# Altium schematic sheet LCD.SchDoc
size A4
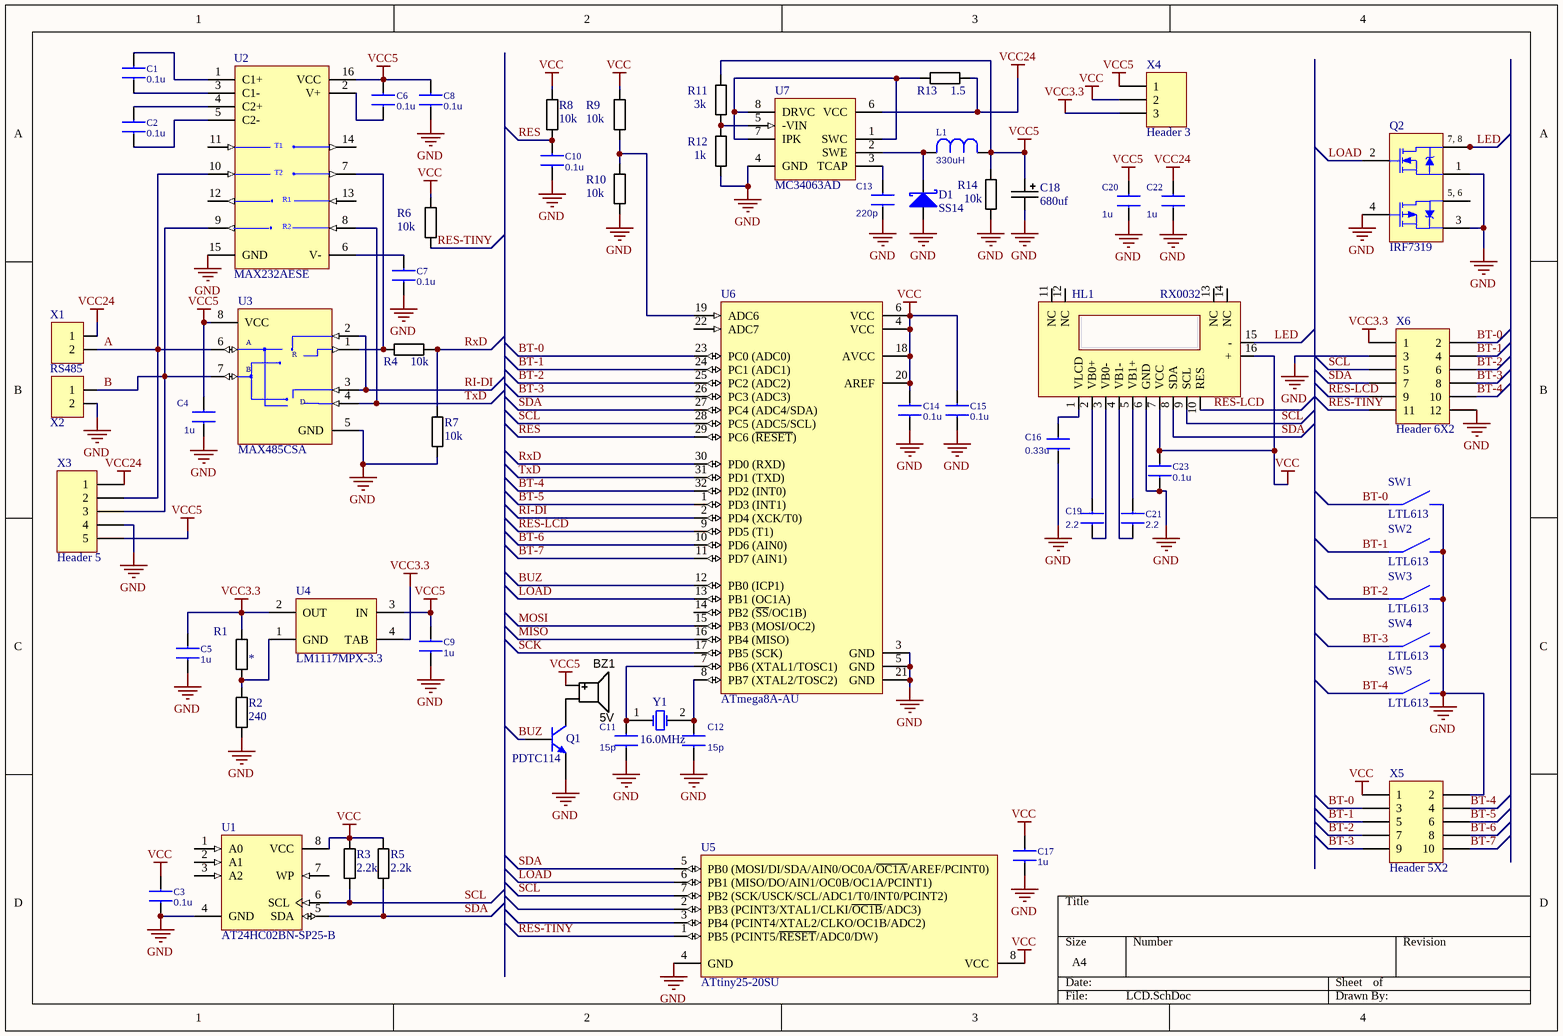
[diagram p0: LCD.SchDoc]

## Parts
BZ1  Manufacturer Part Number 1: 5V  [BUZZER_12.0X8.5MM]  (hidden comment: Alternate part: 3100-932)
C1  0.1u  [C_0805]
C2  0.1u  [C_0805]
C3  0.1u  [C_0805]
C4  1u  [C_0805]
C5  1u  [C_0805]
C6  0.1u  [C_0805]
C7  0.1u  [C_0805]
C8  0.1u  [C_0805]
C9  1u  [C_0805]
C10  0.1u  [C_0805]
C11  15p  [C_0603]
C12  15p  [C_0603]
C13  220p  [C_0805]
C14  0.1u  [C_0805]
C15  0.1u  [C_0805]
C16  0.33u  [C_0805]
C17  1u  [C_0805]
C18  value 680uf  [PCBComponent_1]  (hidden comment: Component_1)
C19  2.2  [C_1206]
C20  1u  [C_0805]
C21  2.2  [C_1206]
C22  1u  [C_0805]
C23  0.1u  [C_0805]
D1  SS14  [DO-214AC]
HL1  RX0032  [RX0032]
L1  330uH  [CDRH74]
Q1  PDTC114  [SOT-23B_N]
Q2  IRF7319  [SO-8]
R1  *  [Resistor 0805]
R2  240  [Resistor 0805]
R3  value 2.2k  [Resistor 0603]  (hidden comment: 3k)
R4  value 10k  [Resistor 0603]  (hidden comment: 3k)
R5  value 2.2k  [Resistor 0603]  (hidden comment: 3k)
R6  value 10k  [Resistor 0603]  (hidden comment: 3k)
R7  value 10k  [Resistor 0603]  (hidden comment: 3k)
R8  value 10k  [Resistor 0603]  (hidden comment: 3k)
R9  value 10k  [Resistor 0603]  (hidden comment: 3k)
R10  value 10k  [Resistor 0603]  (hidden comment: 3k)
R11  3k  [Resistor 0603]
R12  1k  [Resistor 0603]
R13  value 1.5  [Resistor 1206]  (hidden comment: 3k)
R14  value 10k  [Resistor 0603]  (hidden comment: 3k)
SW1  LTL613  [LTL613]
SW2  LTL613  [LTL613]
SW3  LTL613  [LTL613]
SW4  LTL613  [LTL613]
SW5  LTL613  [LTL613]
U1  AT24HC02BN-SP25-B  [8S1_N]
U2  MAX232AESE  [NSO16_N]
U3  MAX485CSA  [NSO8_N]
U4  LM1117MPX-3.3  [MP04A_N]
U5  ATtiny25-20SU  [8S2_N]
U6  ATmega8A-AU  [32A_N]
U7  MC34063AD  [751-02_N]
X1  DG-2P-35  [DG-2P-35]  (value not drawn)
X2  FOR: RS485  [DG-2P-35]  (hidden comment: DG-2P-35)
X3  Header 5  [HDR1X5]
X4  Header 3  [HDR1X3]
X5  Header 5X2  [HDR2X5]
X6  Header 6X2  [HDR2X6]
Y1  value 16.0MHz  [HC49/4H_SMX]  (hidden comment: HC49/4H_SMX)

## Nets
GND: C3.1 C4.1 C5.1 C7.1 C8.1 C9.1 C10.1 C11.1 C12.1 C13.1 C14.1 C15.1 C16.1 C17.2 C18.2 C20.1 C22.1 C23.1 D1.1(A) HL1.6(GND) Q1.3(E) Q2.1(S1) Q2.3(S2) Q2.4(G2) R2.1 R7.1 R10.1 R12.1 R14.1 SW1.1 SW2.1 SW3.1 SW4.1 SW5.1 U1.4(GND) U2.15(GND) U3.5(GND) U5.4(GND) U6.3(GND) U6.5(GND) U6.21(GND) U7.4(GND) X2.2 X3.4 X5.2 X6.3 X6.12
VCC: C3.2 C14.2 C15.2 C17.1 C23.2 HL1.7(VCC) HL1.16(+) R3.2 R5.2 R6.2 R8.2 R9.2 U1.8(VCC) U5.8(VCC) U6.4(VCC) U6.6(VCC) U6.18(AVCC) U6.20(AREF) X4.2 X5.1
VCC3.3: C5.2 R1.2 U4.2(OUT) U4.4(TAB) X4.3 X6.1
VCC5: BZ1.1(Positive) C4.2 C6.2 C8.2 C9.2 C18.1 C20.2 L1.1 R11.1 R14.2 U2.16(VCC) U3.8(VCC) U4.3(IN) X3.5 X4.1
VCC24: C22.2 R13.1 U7.6(VCC) X1.1 X3.1
A: U2.10(T2IN) U3.6(A) X1.2 X3.2
B: U2.9(R2OUT) U3.7(B) X2.1 X3.3
BT-0: SW1.0 U6.23(PC0_(ADC0)) X5.3 X6.2
BT-1: SW2.0 U6.24(PC1_(ADC1)) X5.5 X6.4
BT-2: SW3.0 U6.25(PC2_(ADC2)) X5.7 X6.6
BT-3: SW4.0 U6.26(PC3_(ADC3)) X5.9 X6.8
BT-4: SW5.0 U6.32(PD2_(INT0)) X5.4 X6.10
BT-5: U6.1(PD3_(INT1)) X5.6
BT-6: U6.10(PD6_(AIN0)) X5.8
BT-7: U6.11(PD7_(AIN1)) X5.10
BUZ: Q1.2(B) U6.12(PB0_(ICP1))
LED: HL1.15(-) Q2.7(D1) Q2.8(D1)
LOAD: Q2.2(G1) U5.6(PB1_(MISO/DO/AIN1/OC0B/OC1A/PCINT1)) U6.13(PB1_(OC1A))
MISO: U6.16(PB4_(MISO))
MOSI: U6.15(PB3_(MOSI/OC2))
RES: C10.2 R8.1 U6.29(PC6_(~{RESET}))
RES-LCD: HL1.10(RES) U6.9(PD5_(T1)) X6.9
RES-TINY: R6.1 U5.1(PB5_(PCINT5/~{RESET}/ADC0/DW)) X6.11
RI-DI: U3.2(~{RE}) U3.3(DE) U6.2(PD4_(XCK/T0))
RxD: R4.1 R7.2 U6.30(PD0_(RXD))
SCK: U6.17(PB5_(SCK))
SCL: HL1.9(SCL) R3.1 U1.6(SCL) U5.7(PB2_(SCK/USCK/SCL/ADC1/T0/INT0/PCINT2)) U6.28(PC5_(ADC5/SCL)) X6.5
SDA: HL1.8(SDA) R5.1 U1.5(SDA) U5.5(PB0_(MOSI/DI/SDA/AIN0/OC0A/~{OC1A}/AREF/PCINT0)) U6.27(PC4_(ADC4/SDA)) X6.7
TxD: U2.8(R2IN) U3.4(DI) U6.31(PD1_(TXD))
NetBZ1_2: BZ1.2(Negative) Q1.1(C)
NetC1_1: C1.1 U2.3(C1-)
NetC1_2: C1.2 U2.1(C1+)
NetC2_1: C2.1 U2.5(C2-)
NetC2_2: C2.2 U2.4(C2+)
NetC6_1: C6.1 U2.2(V+)
NetC7_2: C7.2 U2.6(V-)
NetC11_2: C11.2 U6.7(PB6_(XTAL1/TOSC1)) Y1.1(OSC1)
NetC12_2: C12.2 U6.8(PB7_(XTAL2/TOSC2)) Y1.2(OSC2)
NetC13_2: C13.2 U7.3(TCAP)
NetC16_2: C16.2 HL1.1(VLCD)
NetC19_1: C19.1 HL1.3(VB0-)
NetC19_2: C19.2 HL1.2(VB0+)
NetC21_1: C21.1 HL1.4(VB1-)
NetC21_2: C21.2 HL1.5(VB1+)
NetD1_2: D1.2(K) L1.2 U7.2(SWE)
NetQ2_5: Q2.5(D2) Q2.6(D2)
NetR1_1: R1.1 R2.2 U4.1(GND)
NetR4_2: R4.2 U2.7(T2OUT) U3.1(RO)
NetR9_1: R9.1 R10.2 U6.19(ADC6)
NetR11_2: R11.2 R12.2 U7.5(-VIN)
NetR13_2: R13.2 U7.1(SWC) U7.7(IPK) U7.8(DRVC)

Not connected (* = marked no-connect by the designer): HL1 11(NC) 12(NC) 13(NC) 14(NC); U1 1(A0) 2(A1) 3(A2) 7(WP); U2 11(T1IN) 12(R1OUT) 13(R1IN) 14(T1OUT); U5 2(PB3_(PCINT3/XTAL1/CLKI/~{OC1B}/ADC3)) 3(PB4_(PCINT4/XTAL2/CLKO/OC1B/ADC2)); U6 14(PB2_(~{SS}/OC1B)) 22(ADC7)

## Notes on the sheet
- (in symbol IRF7319) 7, 8; 5, 6
- (in symbol MAX232AESE) T1; T2; R1; R2
- (in symbol MAX485CSA) R; D

## Library data of the parts
BZ1 = BZ_12x8.5x6.5_2kHz: Speaker, Magnetic Transducer; Manufacturer 1: CUI Inc; Ratings: 2048 ±200 Hz; SCDType: source; Package / Case: 6.5mm pitch; Material: Noryl SE1-J; Supplier 1: Digi-Key; Supplier Part Number 1: 102-1152-ND
C1-C10 C13-C17 C20 C22 C23 = C0805: Capacitor
  C1-C3 C6-C8 C10 C14 C15 C23: Value: 0.1u
  C4 C5 C9 C17 C20 C22: Value: 1u
  C13: Value: 220p
  C16: Value: 0.33u
C11 C12 = C0603: Capacitor; Value: 15p
C19 C21 = C1206: Capacitor; Value: 2.2
D1 = DS_DO-214: Schottky Diode
L1 = L_CDRH74: Inductor; Value: 330uH
Q1 = QNPN: NPN Bipolar Transistor; pin to pad: 1>3 2>1 3>2; Published: 8-Jun-2000; LatestRevisionDate: 29-May-2009; LatestRevisionNote: IPC-7351 Footprint Added.; PackageVersion: Aug-1999; PackageReference: SOT-23B; Publisher: Altium Limited; PackageDescription: 3-Pin SOT-23 Package 0.95 mm Pitch, 2.4 mm Lead Span
Q2 = IRF7319: HEXFET Power MOSFET; Published: 8-Jun-2000; LatestRevisionDate: 13-Apr-2006; LatestRevisionNote: IPC-7351 Footprint Added.; DatasheetVersion: Sep-1997; PackageVersion: Feb-2001; PackageReference: SO-8; Publisher: Altium Limited; PackageDescription: 8-Pin Plastic Small Outline Integrated Circuit 1.27 mm Pitch; Code_JEDEC: MS-012-AA; Code_IPC: SOIC127P600-8; ComponentLink1Description: Manufacturer Link; ComponentLink1URL: http://www.irf.com/; ComponentLink2Description: Datasheet; ComponentLink2URL: http://www.irf.com/product-info/datasheets/data/IRFN140.pdf
R1-R14 = Resistor
  R1 R2: Value: *
  R11: Value: 3k
  R12: Value: 1k
SW1-SW5 = Button_tact: Tact button switch
U1 = AT24HC02BN-SP25-B: 2Kbit (256 x 8), 2-wire Bus Serial Automotive EEPROM with 1/2 memory Write Protect, 2.5V, 8-Pin SOIC, Bulk; Published: 20-Sep-2010; DatasheetVersion: 5192C,  Jan-2009; PackageVersion: revC, Mar-2005; PackageReference: 8S1; Publisher: Altium Limited; PackageDescription: 8-Lead (0.150" Wide Body), Plastic Gull Wing Small Outline (JEDEC SOIC); Code_JEDEC: MS-012-AA; Code_IPC: SOIC127P600-8; ComponentLink1Description: Manufacturer Link; ComponentLink1URL: http://www.atmel.com/products/serial/default.asp; ComponentLink2Description: Datasheet; ComponentLink2URL: http://www.atmel.com/dyn/resources/prod_documents/doc5192.pdf; ComponentLink3Description: Atmel.com Home; ComponentLink3URL: http://www.atmel.com
U2 = MAX232AESE: +5V-Powered, Multichannel RS-232 Driver/Receiver; Published: 16-Jan-2001; LatestRevisionDate: 13-Apr-2006; LatestRevisionNote: IPC-7351 Footprint Added.; DatasheetVersion: Nov-1997; PackageReference: NSO16; Publisher: Altium Limited; PackageDescription: 16-Pin Small Outline Integrated Circuit 1.27 mm Pitch; Code_JEDEC: MS-012-AC; Code_IPC: SOIC127P600-16; ComponentLink1Description: Manufacturer Link; ComponentLink1URL: http://www.maxim-ic.com/; ComponentLink2Description: Datasheet; ComponentLink2URL: http://pdfserv.maxim-ic.com/en/ds/MAX220-MAX249.pdf
U3 = MAX485CSA: Low-Power, Slew-Rate-Limited RS-485/RS-422 Transceiver; Published: 16-Jan-2001; LatestRevisionDate: 13-Apr-2006; LatestRevisionNote: IPC-7351 Footprint Added.; DatasheetVersion: Feb-1996; PackageReference: NSO8; Publisher: Altium Limited; PackageDescription: 8-Pin Small Outline Integrated Circuit 1.27 mm Pitch; Code_JEDEC: MS-012-AA; Code_IPC: SOIC127P600-8; ComponentLink1Description: Manufacturer Link; ComponentLink1URL: http://www.maxim-ic.com/; ComponentLink2Description: Datasheet; ComponentLink2URL: http://pdfserv.maxim-ic.com/en/ds/MAX1487-MAX491.pdf
U4 = LM1117MPX-3.3: 800mA Low-Dropout Linear Regulator, 4-pin SOT-223; Manufacturer: National Semiconductor; PackageTopMarking: XYTT*N05A; PowerWise: N; CompType: LDO IC; Published: 1-Mar-2010; DatasheetVersion: Apr-2006; PackageVersion: revB, Apr-2003; PackageReference: MP04A; Publisher: Altium Limited; PackageDescription: Molded SOT-223, 6.50 x 3.56 x 1.6mm Body, 4 Lead, 2.3mm Pitch; Supplier 1: Farnell; Supplier Part Number 1: 1652313; PartNumber: LM1117MPX-3.3; RoHS: N; PinCount: 4; Code_JEDEC: TO-261-AA; Code_IPC: SOT223-4; ComponentLink1Description: LM1117 Datasheet; ComponentLink1URL: http://www.national.com/ds/LM/LM1117.pdf; ComponentLink2Description: LM1117 Web Page; ComponentLink2URL: http://www.national.com/pf/LM/LM1117.html; ComponentLink3Description: MP04A Package Page; ComponentLink3URL: http://www.national.com/packaging/folders/mp04a.html
U5 = ATtiny25-20SU: 8-bit AVR Microcontroller, 2.7-5.5V, 2KB Flash, 128 Bytes EEPROM, 128 Bytes SRAM, 8-pin SOP, Industrial Grade (-40°C to 85°C), Pb-Free; Published: 1-Apr-2010; DatasheetVersion: revK, Jan-2008; PackageVersion: revF, Apr-2008; PackageReference: 8S2; Publisher: Altium Limited; PackageDescription: 8-Lead, 0.208" Body, Plastic Small Outline Package (EIAJ); Supplier 1: Digi-Key; Supplier Part Number 1: ATTINY25-20SU-ND; Supplier 2: Farnell; Supplier Part Number 2: 1455143; Supplier 3: Mouser; Supplier Part Number 3: 556-ATTINY25-20SU; ComponentLink1Description: Manufacturer Link; ComponentLink1URL: http://www.atmel.com/products/avr/default.asp?; ComponentLink2Description: ATtiny25/45/85 Datasheet; ComponentLink2URL: http://www.atmel.com/dyn/resources/prod_documents/doc2586.pdf; ComponentLink3Description: ATtiny25/45/85 Summary; ComponentLink3URL: http://www.atmel.com/dyn/resources/prod_documents/2586S.pdf; ComponentLink4Description: Atmel.com Home; ComponentLink4URL: http://www.atmel.com
U6 = ATmega8A-AU: 8-bit AVR Microcontroller, 8KB Flash, 512 Bytes EEPROM, 1KB SRAM, 32-pin TQFP, Industrial Grade (-40°C to 85°C); Published: 1-Apr-2010; DatasheetVersion: revC, Jul-2009; PackageVersion: revB, Oct-2001; PackageReference: 32A; Publisher: Altium Limited; PackageDescription: 32-Lead, 7x7x1.0 mm Body, 0.8mm Lead Pitch, Thin Profile Plastic Quad Flat Package (TQFP); Supplier 1: Digi-Key; Supplier Part Number 1: ATMEGA8A-AU-ND; Supplier 2: Farnell; Supplier Part Number 2: 1748532; Supplier 3: Mouser; Supplier Part Number 3: 556-ATMEGA8A-AU; Code_JEDEC: MS-026-ABA; ComponentLink1Description: Manufacturer Link; ComponentLink1URL: http://www.atmel.com/products/avr/default.asp?; ComponentLink2Description: ATmega8A Datasheet; ComponentLink2URL: http://www.atmel.com/dyn/resources/prod_documents/doc8159.pdf; ComponentLink3Description: ATmega8A Summary; ComponentLink3URL: http://www.atmel.com/dyn/resources/prod_documents/8159S.pdf; ComponentLink4Description: Atmel.com Home; ComponentLink4URL: http://www.atmel.com
U7 = MC34063AD: DC-to-DC Converter Control Circuit; Published: 17-Jul-2002; LatestRevisionDate: 13-Apr-2006; LatestRevisionNote: IPC-7351 Footprint Added.; DatasheetVersion: 1988; PackageReference: 751-02; Publisher: Altium Limited; PackageDescription: 8-Pin Small Outline Integrated Circuit 1.27 mm Pitch; Code_JEDEC: MS-012-AA; Code_IPC: SOIC127P600-8; ComponentLink1Description: Manufacturer Link; ComponentLink1URL: http://www.onsemi.com/site/products/taxonomy/0,4438,503,00.html; ComponentLink2Description: Datasheet; ComponentLink2URL: http://www.onsemi.com/pub/Collateral/MC34063A-D.PDF
X3 = Header 5: Header, 5-Pin; LatestRevisionDate: 17-Jul-2002; LatestRevisionNote: Re-released for DXP Platform.; Publisher: Altium Limited
X4 = Header 3: Header, 3-Pin; LatestRevisionDate: 17-Jul-2002; LatestRevisionNote: Re-released for DXP Platform.; Publisher: Altium Limited
X5 = Header 5X2: Header, 5-Pin, Dual row; LatestRevisionDate: 17-Jul-2002; LatestRevisionNote: Re-released for DXP Platform.; Publisher: Altium Limited
X6 = Header 6X2: Header, 6-Pin, Dual row; LatestRevisionDate: 17-Jul-2002; LatestRevisionNote: Re-released for DXP Platform.; Publisher: Altium Limited
Y1 = HC49/4H_SMX: Surface Mount Quartz Crystal; Note: PCB layout complies with manufacturer's recommendation.; Published: 17-Jul-2002; DatasheetDocument: 18-Oct-1999; PackageDocument: 18-Oct-1999; PackageReference: HC49/4H_SMX; Publisher: Altium Limited; ComponentLink1Description: Manufacturer Link; ComponentLink1URL: http://www.cmac.com/mt/; ComponentLink2Description: Datasheet; ComponentLink2URL: http://www.cmac.com/mt/databook/crystals/smd/hc49_4h_smx.pdf